# Altium project B100AA Development Kit.PrjPcb (part 2 of 5)

## Sheet Digital Port C State LED Inducator.SchDoc: PORT State LED Inducator
size A3; ApprovedBy: Mehmet Günce Akkoyun; CheckedBy: Mehmet Günce Akkoyun; Author: Mehmet Günce Akkoyun; CompanyName: Ovoo Electronics; DrawnBy: Mehmet Günce Akkoyun; Engineer: Mehmet Günce Akkoyun; Organization: Ovoo Electronics; Address1: Necip Fazýl Mah. Ortaýrmak Sok.; Address2: Birgül Apt. No: 19/6; Address3: Meram / Konya; Address4: Turkiye; DocumentNumber: AA001; Revision: B100AA Dev Kit
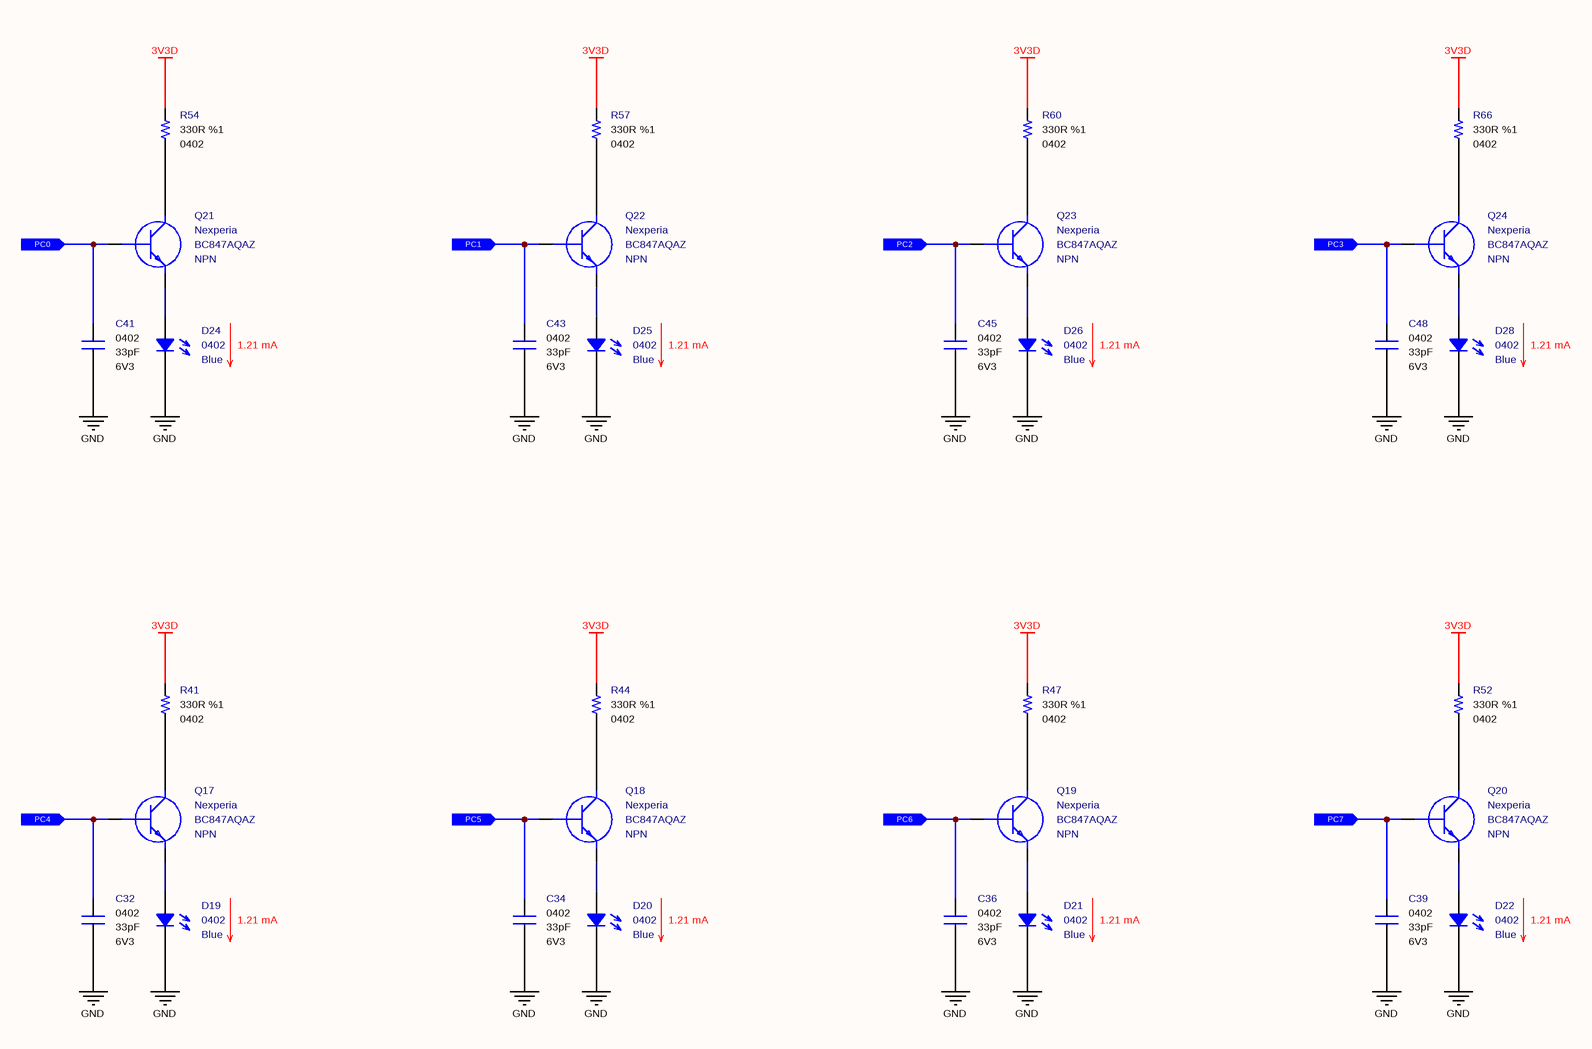
[diagram p8: Digital Port C State LED Inducator.SchDoc]

### Parts
C32  value 33pF  Case: 0402  Voltage: 6V3  [CAPACITOR_0402]  (hidden comment: Multilayer Ceramic Capacitor)
C34  value 33pF  Case: 0402  Voltage: 6V3  [CAPACITOR_0402]  (hidden comment: Multilayer Ceramic Capacitor)
C36  value 33pF  Case: 0402  Voltage: 6V3  [CAPACITOR_0402]  (hidden comment: Multilayer Ceramic Capacitor)
C39  value 33pF  Case: 0402  Voltage: 6V3  [CAPACITOR_0402]  (hidden comment: Multilayer Ceramic Capacitor)
C41  value 33pF  Case: 0402  Voltage: 6V3  [CAPACITOR_0402]  (hidden comment: Multilayer Ceramic Capacitor)
C43  value 33pF  Case: 0402  Voltage: 6V3  [CAPACITOR_0402]  (hidden comment: Multilayer Ceramic Capacitor)
C45  value 33pF  Case: 0402  Voltage: 6V3  [CAPACITOR_0402]  (hidden comment: Multilayer Ceramic Capacitor)
C48  value 33pF  Case: 0402  Voltage: 6V3  [CAPACITOR_0402]  (hidden comment: Multilayer Ceramic Capacitor)
D19  Case: 0402  Color: Blue  [LED_0402]  (hidden comment: SMD LED (Blue))
D20  Case: 0402  Color: Blue  [LED_0402]  (hidden comment: SMD LED (Blue))
D21  Case: 0402  Color: Blue  [LED_0402]  (hidden comment: SMD LED (Blue))
D22  Case: 0402  Color: Blue  [LED_0402]  (hidden comment: SMD LED (Blue))
D24  Case: 0402  Color: Blue  [LED_0402]  (hidden comment: SMD LED (Blue))
D25  Case: 0402  Color: Blue  [LED_0402]  (hidden comment: SMD LED (Blue))
D26  Case: 0402  Color: Blue  [LED_0402]  (hidden comment: SMD LED (Blue))
D28  Case: 0402  Color: Blue  [LED_0402]  (hidden comment: SMD LED (Blue))
Q17  Manufacturer_Name: Nexperia  Manufacturer_Part_Number: BC847AQAZ  Polarity: NPN  [SOT1215]  (hidden comment: Bipolar NPN Transistors)
Q18  Manufacturer_Name: Nexperia  Manufacturer_Part_Number: BC847AQAZ  Polarity: NPN  [SOT1215]  (hidden comment: Bipolar NPN Transistors)
Q19  Manufacturer_Name: Nexperia  Manufacturer_Part_Number: BC847AQAZ  Polarity: NPN  [SOT1215]  (hidden comment: Bipolar NPN Transistors)
Q20  Manufacturer_Name: Nexperia  Manufacturer_Part_Number: BC847AQAZ  Polarity: NPN  [SOT1215]  (hidden comment: Bipolar NPN Transistors)
Q21  Manufacturer_Name: Nexperia  Manufacturer_Part_Number: BC847AQAZ  Polarity: NPN  [SOT1215]  (hidden comment: Bipolar NPN Transistors)
Q22  Manufacturer_Name: Nexperia  Manufacturer_Part_Number: BC847AQAZ  Polarity: NPN  [SOT1215]  (hidden comment: Bipolar NPN Transistors)
Q23  Manufacturer_Name: Nexperia  Manufacturer_Part_Number: BC847AQAZ  Polarity: NPN  [SOT1215]  (hidden comment: Bipolar NPN Transistors)
Q24  Manufacturer_Name: Nexperia  Manufacturer_Part_Number: BC847AQAZ  Polarity: NPN  [SOT1215]  (hidden comment: Bipolar NPN Transistors)
R41  value 330R  Tolerance: %1  Case: 0402  [RESISTOR_0402]  (hidden comment: Thick Film Resistor)
R44  value 330R  Tolerance: %1  Case: 0402  [RESISTOR_0402]  (hidden comment: Thick Film Resistor)
R47  value 330R  Tolerance: %1  Case: 0402  [RESISTOR_0402]  (hidden comment: Thick Film Resistor)
R52  value 330R  Tolerance: %1  Case: 0402  [RESISTOR_0402]  (hidden comment: Thick Film Resistor)
R54  value 330R  Tolerance: %1  Case: 0402  [RESISTOR_0402]  (hidden comment: Thick Film Resistor)
R57  value 330R  Tolerance: %1  Case: 0402  [RESISTOR_0402]  (hidden comment: Thick Film Resistor)
R60  value 330R  Tolerance: %1  Case: 0402  [RESISTOR_0402]  (hidden comment: Thick Film Resistor)
R66  value 330R  Tolerance: %1  Case: 0402  [RESISTOR_0402]  (hidden comment: Thick Film Resistor)

### Ports
PC0 (in), PC1 (in), PC2 (in), PC3 (in), PC4 (in), PC5 (in), PC6 (in), PC7 (in)

### Nets
3V3D: R41.2 R44.2 R47.2 R52.2 R54.2 R57.2 R60.2 R66.2
GND: C32.2 C34.2 C36.2 C39.2 C41.2 C43.2 C45.2 C48.2 D19.1 D20.1 D21.1 D22.1 D24.1 D25.1 D26.1 D28.1
PC0: C41.1 Q21.1(B) ; port PC0
PC1: C43.1 Q22.1(B) ; port PC1
PC2: C45.1 Q23.1(B) ; port PC2
PC3: C48.1 Q24.1(B) ; port PC3
PC4: C32.1 Q17.1(B) ; port PC4
PC5: C34.1 Q18.1(B) ; port PC5
PC6: C36.1 Q19.1(B) ; port PC6
PC7: C39.1 Q20.1(B) ; port PC7
NetD19_2: D19.2 Q17.2(E)
NetD20_2: D20.2 Q18.2(E)
NetD21_2: D21.2 Q19.2(E)
NetD22_2: D22.2 Q20.2(E)
NetD24_2: D24.2 Q21.2(E)
NetD25_2: D25.2 Q22.2(E)
NetD26_2: D26.2 Q23.2(E)
NetD28_2: D28.2 Q24.2(E)
NetQ17_3: Q17.3(C) R41.1
NetQ18_3: Q18.3(C) R44.1
NetQ19_3: Q19.3(C) R47.1
NetQ20_3: Q20.3(C) R52.1
NetQ21_3: Q21.3(C) R54.1
NetQ22_3: Q22.3(C) R57.1
NetQ23_3: Q23.3(C) R60.1
NetQ24_3: Q24.3(C) R66.1

### Notes on the sheet
- 1.21 mA
- Title
- Size:
- Date:
- A3
- Number:
- Time:
- Revision:
- Sheet
- of
- File:

### Library data of the parts
C32 C34 C36 C39 C41 C43 C45 C48 = Capacitor - 33pF [0402-6V3]: as C2 on sheet Digital Port A State LED Inducator; Height: 0.5mm; Maximum Operating Temperature: +125; Minimum Operating Temperature: -55; ROHS: Yes; ComponentLink1Description: DataSheet; ComponentLink1URL: https://api.kemet.com/component-edge/download/datasheet/C0402C330J9RACAUTO.pdf; ComponentLink2Description: Mouser; ComponentLink2URL: https://www.mouser.com/Search/Refine.aspx?Keyword=80-C0402C330J9RAUTO; Supplier 1: Mouser; Supplier Part Number 1: 80-C0402C330J9RAUTO; Mouser Part Number: 80-C0402C330J9RAUTO
D19-D22 D24-D26 D28 = Diode - LED (0402-Blue): as D1 on sheet Digital Port A State LED Inducator; Mouser_Part_Number: 755-SMLP13BC8TT86; ROHS: Yes; ComponentLink1Description: DataSheet; ComponentLink1URL: https://d1d2qsbl8m0m72.cloudfront.net/en/products/databook/datasheet/opto/led/chip_mono/sml-p1-e.pdf; ComponentLink2Description: Mouser; ComponentLink2URL: https://www.mouser.com.tr/ProductDetail/ROHM-Semiconductor/SMLP13BC8TT86?qs=%2Fha2pyFaduidYDgXFKL%252BNZwCVZNUI4FlyPWWbVDx1b6ABmzS%252BS2f0w%3D%3D; Supplier 1: Mouser; Supplier 2: Digi-Key; Supplier Part Number 1: 755-SMLP13BC8TT86; Supplier Part Number 2: 846-1112-1-ND
Q17-Q24 = Transistor - BC847: as Q1 on sheet Digital Port A State LED Inducator; Mouser_Part_Number: 771-BC847AQAZ; ComponentLink1Description: DataSheet; ComponentLink1URL: https://www.mouser.com.tr/datasheet/2/916/BC847XQA_SER-1598405.pdf; ComponentLink2Description: Mouser; ComponentLink2URL: https://www.mouser.com.tr/ProductDetail/Nexperia/BC847AQAZ?qs=%2Fha2pyFaduhKMCPKNtQimeJpXTw9z4AqURd2YARs8DVICZNv3AT9Dw%3D%3D; Case: DFN-1010D-3; Supplier 1: Mouser; Supplier 2: Digi-Key; Supplier Part Number 1: 771-BC847AQAZ; Supplier Part Number 2: 1727-2545-1-ND
R41 R44 R47 R52 R54 R57 R60 R66 = Resistor - 330R: as R2 on sheet Digital Port A State LED Inducator; Height: 0.4mm; ComponentLink1Description: DataSheet; ComponentLink1URL: https://www.mouser.com.tr/datasheet/2/427/dcrcwe3-1762152.pdf; ComponentLink2Description: Mouser; ComponentLink2URL: https://www.mouser.com.tr/ProductDetail/Vishay-Dale/CRCW0402330RFKED?qs=sGAEpiMZZMu61qfTUdNhG2DpbjADlD3GGS6SwBlLi5Q%3D; Supplier 1: Mouser; Supplier 2: Digi-Key; Supplier Part Number 2: 541-330LCT-ND; Supplier Part Number 1: 71-CRCW0402-330-E3; Mouser Part Number: 71-CRCW0402-330-E3

## Sheet Digital Port C Button.SchDoc: PORT State Change Buttons
size A4; ApprovedBy: Mehmet Günce Akkoyun; CheckedBy: Mehmet Günce Akkoyun; Author: Mehmet Günce Akkoyun; CompanyName: Ovoo Electronics; DrawnBy: Mehmet Günce Akkoyun; Engineer: Mehmet Günce Akkoyun; Organization: Ovoo Electronics; Address1: Necip Fazýl Mah. Ortaýrmak Sok.; Address2: Birgül Apt. No: 19/6; Address3: Meram / Konya; Address4: Turkiye; DocumentNumber: AA001; Revision: B100AA Dev Kit
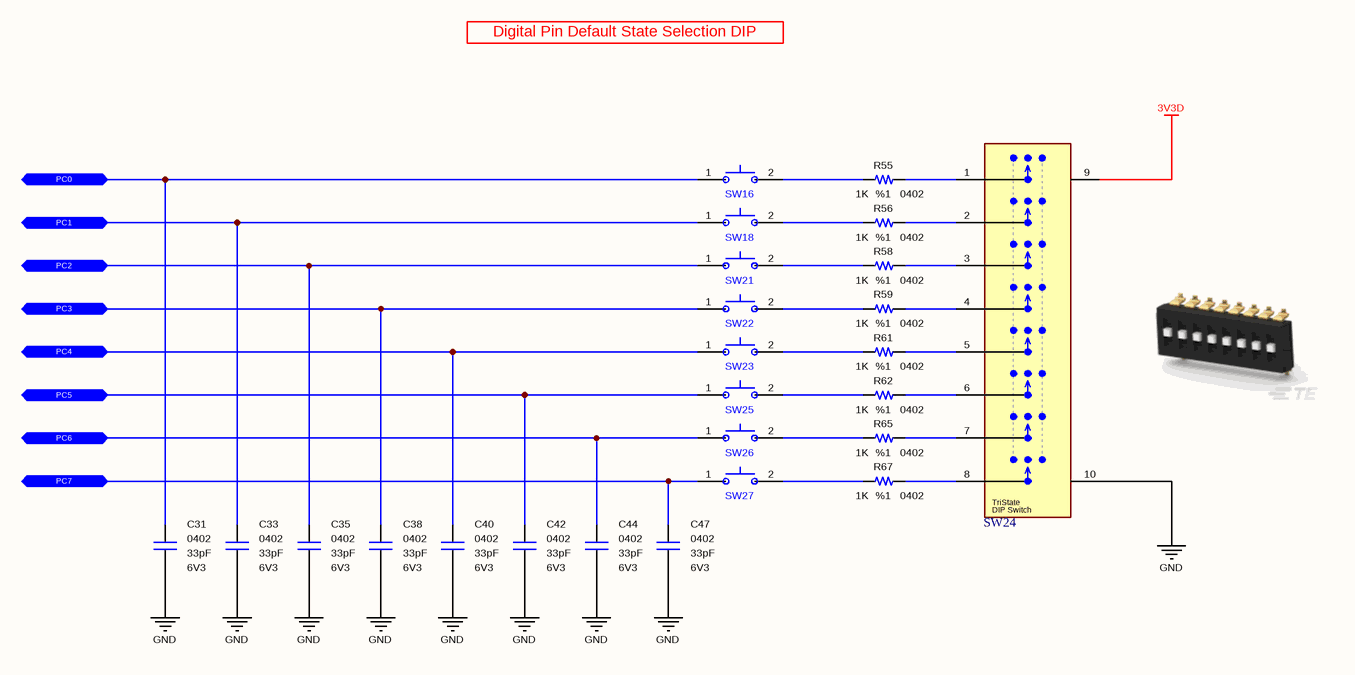
[diagram p9: Digital Port C Button.SchDoc]

### Parts
C31  value 33pF  Case: 0402  Voltage: 6V3  [CAPACITOR_0402]  (hidden comment: Multilayer Ceramic Capacitor)
C33  value 33pF  Case: 0402  Voltage: 6V3  [CAPACITOR_0402]  (hidden comment: Multilayer Ceramic Capacitor)
C35  value 33pF  Case: 0402  Voltage: 6V3  [CAPACITOR_0402]  (hidden comment: Multilayer Ceramic Capacitor)
C38  value 33pF  Case: 0402  Voltage: 6V3  [CAPACITOR_0402]  (hidden comment: Multilayer Ceramic Capacitor)
C40  value 33pF  Case: 0402  Voltage: 6V3  [CAPACITOR_0402]  (hidden comment: Multilayer Ceramic Capacitor)
C42  value 33pF  Case: 0402  Voltage: 6V3  [CAPACITOR_0402]  (hidden comment: Multilayer Ceramic Capacitor)
C44  value 33pF  Case: 0402  Voltage: 6V3  [CAPACITOR_0402]  (hidden comment: Multilayer Ceramic Capacitor)
C47  value 33pF  Case: 0402  Voltage: 6V3  [CAPACITOR_0402]  (hidden comment: Multilayer Ceramic Capacitor)
R55  value 1K  Tolerance: %1  Case: 0402  [RESISTOR_0402]  (hidden comment: Thick Film Resistor)
R56  value 1K  Tolerance: %1  Case: 0402  [RESISTOR_0402]  (hidden comment: Thick Film Resistor)
R58  value 1K  Tolerance: %1  Case: 0402  [RESISTOR_0402]  (hidden comment: Thick Film Resistor)
R59  value 1K  Tolerance: %1  Case: 0402  [RESISTOR_0402]  (hidden comment: Thick Film Resistor)
R61  value 1K  Tolerance: %1  Case: 0402  [RESISTOR_0402]  (hidden comment: Thick Film Resistor)
R62  value 1K  Tolerance: %1  Case: 0402  [RESISTOR_0402]  (hidden comment: Thick Film Resistor)
R65  value 1K  Tolerance: %1  Case: 0402  [RESISTOR_0402]  (hidden comment: Thick Film Resistor)
R67  value 1K  Tolerance: %1  Case: 0402  [RESISTOR_0402]  (hidden comment: Thick Film Resistor)
SW16  Tactile Switches  [PTS526_Switch]  (value not drawn)
SW18  Tactile Switches  [PTS526_Switch]  (value not drawn)
SW21  Tactile Switches  [PTS526_Switch]  (value not drawn)
SW22  Tactile Switches  [PTS526_Switch]  (value not drawn)
SW23  Tactile Switches  [PTS526_Switch]  (value not drawn)
SW24  DIP Switches/SIP Switches  [TDS08SGNNTR04]  (value not drawn)
SW25  Tactile Switches  [PTS526_Switch]  (value not drawn)
SW26  Tactile Switches  [PTS526_Switch]  (value not drawn)
SW27  Tactile Switches  [PTS526_Switch]  (value not drawn)

### Ports
PC0 (bidir), PC1 (bidir), PC2 (bidir), PC3 (bidir), PC4 (bidir), PC5 (bidir), PC6 (bidir), PC7 (bidir)

### Nets
3V3D: SW24.9(VCC)
GND: C31.1 C33.1 C35.1 C38.1 C40.1 C42.1 C44.1 C47.1 SW24.10(GND)
PC0: C31.2 SW16.1(NC) ; port PC0
PC1: C33.2 SW18.1(NC) ; port PC1
PC2: C35.2 SW21.1(NC) ; port PC2
PC3: C38.2 SW22.1(NC) ; port PC3
PC4: C40.2 SW23.1(NC) ; port PC4
PC5: C42.2 SW25.1(NC) ; port PC5
PC6: C44.2 SW26.1(NC) ; port PC6
PC7: C47.2 SW27.1(NC) ; port PC7
NetR55_1: R55.1 SW24.1
NetR55_2: R55.2 SW16.2(COM)
NetR56_1: R56.1 SW24.2
NetR56_2: R56.2 SW18.2(COM)
NetR58_1: R58.1 SW24.3
NetR58_2: R58.2 SW21.2(COM)
NetR59_1: R59.1 SW24.4
NetR59_2: R59.2 SW22.2(COM)
NetR61_1: R61.1 SW24.5
NetR61_2: R61.2 SW23.2(COM)
NetR62_1: R62.1 SW24.6
NetR62_2: R62.2 SW25.2(COM)
NetR65_1: R65.1 SW24.7
NetR65_2: R65.2 SW26.2(COM)
NetR67_1: R67.1 SW24.8
NetR67_2: R67.2 SW27.2(COM)

### Notes on the sheet
- Digital Pin Default State Selection DIP
- Title
- Size:
- Date:
- A4
- Number:
- Time:
- Revision:
- Sheet
- of
- File:
- (in symbol Switch - DIP Switch (8 Pole TriState)) TriState; DIP Switch

### Library data of the parts
C31 C33 C35 C38 C40 C42 C44 C47 = Capacitor - 33pF [0402-6V3]: as C2 on sheet Digital Port A State LED Inducator; Height: 0.5mm; Mouser Part Number: 80-C0402C330J9RAUTO; Maximum Operating Temperature: +125; Minimum Operating Temperature: -55; ROHS: Yes; ComponentLink1Description: DataSheet; ComponentLink1URL: https://api.kemet.com/component-edge/download/datasheet/C0402C330J9RACAUTO.pdf; ComponentLink2Description: Mouser; ComponentLink2URL: https://www.mouser.com/Search/Refine.aspx?Keyword=80-C0402C330J9RAUTO; Supplier 1: Mouser; Supplier Part Number 1: 80-C0402C330J9RAUTO
R55 R56 R58 R59 R61 R62 R65 R67 = Resistor - 1K: as R18 on sheet Digital Port A Button; Height: 0.35mm; Mouser Part Number: 71-CRCW0402-1.0K-E3; ComponentLink1Description: DataSheet; ComponentLink1URL: https://www.mouser.com.tr/datasheet/2/427/dcrcwe3-1762152.pdf; ComponentLink2Description: Mouser; ComponentLink2URL: https://www.mouser.com.tr/ProductDetail/Vishay-Dale/CRCW04021K00FKED?qs=sGAEpiMZZMu61qfTUdNhG2DpbjADlD3GFJ4zSbeLqG8%3D; Supplier 1: Mouser; Supplier 2: Digi-Key; Supplier Part Number 1: 71-CRCW0402-1.0K-E3; Supplier Part Number 2: 541-1.00KLCT-ND
SW16 SW18 SW21-SW23 SW25-SW27 = Switch - Tactile: as SW1 on sheet Digital Port A Button; Height: 0.8mm; Mouser Part Number: 611-PTS526SK08SMTR2L; ComponentLink1Description: DataSheet; ComponentLink1URL: https://eu.mouser.com/datasheet/2/60/pts526-1651200.pdf; ComponentLink2Description: Mouser; ComponentLink2URL: https://eu.mouser.com/ProductDetail/CK/PTS526-SK08-SMTR2-LFS?qs=sGAEpiMZZMsgGjVA3toVBL%2FRce%252ByN3s1hQPqiLlQ%252BeM%3D; Supplier 1: Future Electronics; Supplier 2: Mouser; Supplier 3: Arrow; Supplier 4: Digi-Key; Supplier Part Number 1: PTS526SK08SMTR2LFS-REEL; Supplier Part Number 2: 611-PTS526SK08SMTR2L; Supplier Part Number 3: PTS526 SK08 SMTR2 LFS; Supplier Part Number 4: CKN12219-1-ND
SW24 = Switch - DIP Switch (8 Pole TriState): as SW2 on sheet Digital Port A Default State DIP; Manufacturer Part Number: TDS08SGNNTR04; Mouser Part Number: 506-TDS08SGNNTR04; ComponentLink1Description: DataSheet; ComponentLink1URL: https://www.mouser.com.tr/datasheet/2/418/4/NG_DS_1-1773931-8_ALCOSWITCH_DIP_TDS_0917-1221113.pdf; ComponentLink2Description: Mouser; ComponentLink2URL: https://www.mouser.com.tr/ProductDetail/TE-Connectivity-Alcoswitch/TDS08SGNNTR04/?qs=wd5RIQLrsJiLOOX2pWoyQw==

## Sheet Digital Port F.SchDoc: Port F Digital Control
size A4; ApprovedBy: Mehmet Günce Akkoyun; CheckedBy: Mehmet Günce Akkoyun; Author: Mehmet Günce Akkoyun; CompanyName: Ovoo Electronics; DrawnBy: Mehmet Günce Akkoyun; Engineer: Mehmet Günce Akkoyun; Organization: Ovoo Electronics; Address1: Necip Fazýl Mah. Ortaýrmak Sok.; Address2: Birgül Apt. No: 19/6; Address3: Meram / Konya; Address4: Turkiye; DocumentNumber: AA001; Revision: B100AA Dev Kit
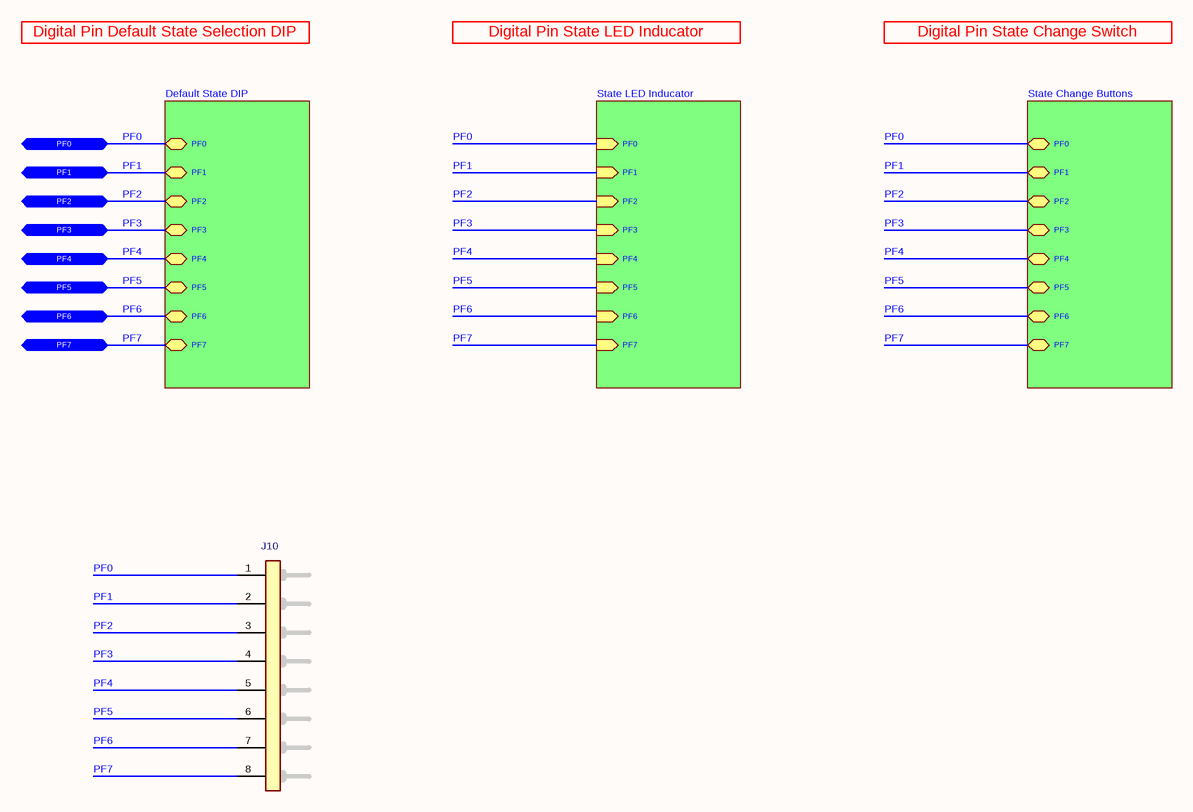
[diagram p10: Digital Port F.SchDoc]

### Parts
J10  2.54 mm Pitch 8P Male Connector  [8P Header]  (value not drawn)

### Sub-sheets
Default State DIP = Digital Port F Default State DIP.SchDoc: PF1 (bidir), PF0 (bidir), PF7 (bidir), PF4 (bidir), PF6 (bidir), PF3 (bidir), PF5 (bidir), PF2 (bidir)
State Change Buttons = Digital Port F Button.SchDoc: PF1 (bidir), PF0 (bidir), PF7 (bidir), PF4 (bidir), PF6 (bidir), PF3 (bidir), PF5 (bidir), PF2 (bidir)
State LED Inducator = Digital Port F State LED Inducator.SchDoc: PF1 (in), PF0 (in), PF7 (in), PF4 (in), PF6 (in), PF3 (in), PF5 (in), PF2 (in)

### Ports
PF0 (bidir), PF1 (bidir), PF2 (bidir), PF3 (bidir), PF4 (bidir), PF5 (bidir), PF6 (bidir), PF7 (bidir)

### Nets
PF0: J10.1(Pin-1) ; port PF0, sheet Default State DIP/PF0, sheet State LED Inducator/PF0, sheet State Change Buttons/PF0
PF1: J10.2(Pin-2) ; port PF1, sheet Default State DIP/PF1, sheet State LED Inducator/PF1, sheet State Change Buttons/PF1
PF2: J10.3(Pin-3) ; port PF2, sheet Default State DIP/PF2, sheet State LED Inducator/PF2, sheet State Change Buttons/PF2
PF3: J10.4(Pin-4) ; port PF3, sheet Default State DIP/PF3, sheet State LED Inducator/PF3, sheet State Change Buttons/PF3
PF4: J10.5(Pin-5) ; port PF4, sheet Default State DIP/PF4, sheet State LED Inducator/PF4, sheet State Change Buttons/PF4
PF5: J10.6(Pin-6) ; port PF5, sheet Default State DIP/PF5, sheet State LED Inducator/PF5, sheet State Change Buttons/PF5
PF6: J10.7(Pin-7) ; port PF6, sheet Default State DIP/PF6, sheet State LED Inducator/PF6, sheet State Change Buttons/PF6
PF7: J10.8(Pin-8) ; port PF7, sheet Default State DIP/PF7, sheet State LED Inducator/PF7, sheet State Change Buttons/PF7

### Notes on the sheet
- Digital Pin Default State Selection DIP
- Digital Pin State LED Inducator
- Digital Pin State Change Switch
- Title
- Size:
- Date:
- A4
- Number:
- Time:
- Revision:
- Sheet
- of
- File:

### Library data of the parts
J10 = Connector - Male Header 8P (2.54): Headers & Wire Housings BREAKAWAY HDR VERT 8; Manufacturer Name: Molex; Position: 8; Row: 1; Pitch: 2.54 mm; Manufacturer Part Number: 22-28-4083; Mouser Part Number: 538-22-28-4083; ROHS: Yes; ComponentLink1Description: DataSheet; ComponentLink1URL: https://www.mouser.com.tr/datasheet/2/276/0022284063_PCB_HEADERS-228265.pdf; ComponentLink2Description: Mouser; ComponentLink2URL: https://www.mouser.com.tr/ProductDetail/Molex/22-28-4083/?qs=%2Fha2pyFaduguMWEp6M%252Bj0x6fHxUvnRGD%252BIxBoa6MO5w%3D

## Sheet Digital Port F Default State DIP.SchDoc: PORT F Default State Selection Switch
size A4; ApprovedBy: Mehmet Günce Akkoyun; CheckedBy: Mehmet Günce Akkoyun; Author: Mehmet Günce Akkoyun; CompanyName: Ovoo Electronics; DrawnBy: Mehmet Günce Akkoyun; Engineer: Mehmet Günce Akkoyun; Organization: Ovoo Electronics; Address1: Necip Fazýl Mah. Ortaýrmak Sok.; Address2: Birgül Apt. No: 19/6; Address3: Meram / Konya; Address4: Turkiye; DocumentNumber: AA001; Revision: B100AA Dev Kit
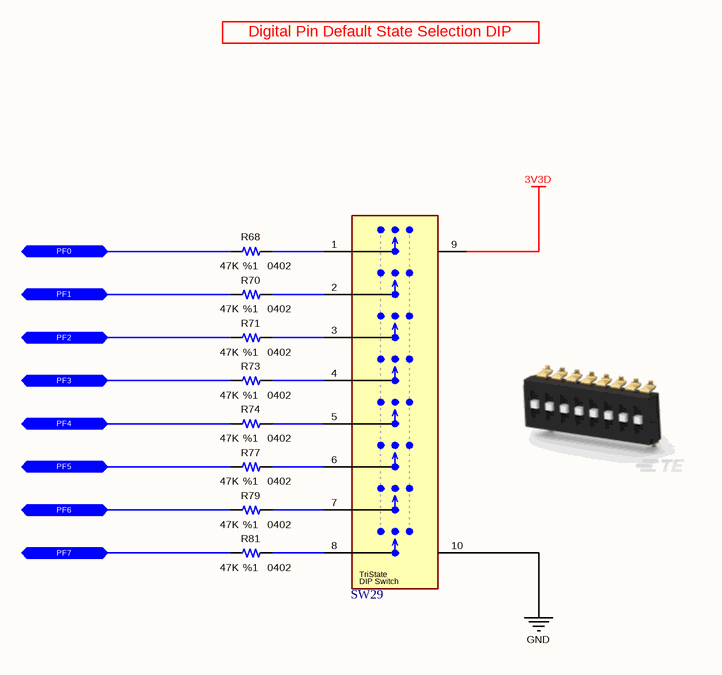
[diagram p11: Digital Port F Default State DIP.SchDoc]

### Parts
R68  value 47K  Tolerance: %1  Case: 0402  [RESISTOR_0402]  (hidden comment: Thick Film Resistor)
R70  value 47K  Tolerance: %1  Case: 0402  [RESISTOR_0402]  (hidden comment: Thick Film Resistor)
R71  value 47K  Tolerance: %1  Case: 0402  [RESISTOR_0402]  (hidden comment: Thick Film Resistor)
R73  value 47K  Tolerance: %1  Case: 0402  [RESISTOR_0402]  (hidden comment: Thick Film Resistor)
R74  value 47K  Tolerance: %1  Case: 0402  [RESISTOR_0402]  (hidden comment: Thick Film Resistor)
R77  value 47K  Tolerance: %1  Case: 0402  [RESISTOR_0402]  (hidden comment: Thick Film Resistor)
R79  value 47K  Tolerance: %1  Case: 0402  [RESISTOR_0402]  (hidden comment: Thick Film Resistor)
R81  value 47K  Tolerance: %1  Case: 0402  [RESISTOR_0402]  (hidden comment: Thick Film Resistor)
SW29  DIP Switches/SIP Switches  [TDS08SGNNTR04]  (value not drawn)

### Ports
PF0 (bidir), PF1 (bidir), PF2 (bidir), PF3 (bidir), PF4 (bidir), PF5 (bidir), PF6 (bidir), PF7 (bidir)

### Nets
3V3D: SW29.9(VCC)
GND: SW29.10(GND)
PF0: R68.2 ; port PF0
PF1: R70.2 ; port PF1
PF2: R71.2 ; port PF2
PF3: R73.2 ; port PF3
PF4: R74.2 ; port PF4
PF5: R77.2 ; port PF5
PF6: R79.2 ; port PF6
PF7: R81.2 ; port PF7
NetR68_1: R68.1 SW29.1
NetR70_1: R70.1 SW29.2
NetR71_1: R71.1 SW29.3
NetR73_1: R73.1 SW29.4
NetR74_1: R74.1 SW29.5
NetR77_1: R77.1 SW29.6
NetR79_1: R79.1 SW29.7
NetR81_1: R81.1 SW29.8

### Notes on the sheet
- Digital Pin Default State Selection DIP
- Title
- Size:
- Date:
- A4
- Number:
- Time:
- Revision:
- Sheet
- of
- File:
- (in symbol Switch - DIP Switch (8 Pole TriState)) TriState; DIP Switch

### Library data of the parts
R68 R70 R71 R73 R74 R77 R79 R81 = Resistor - 47K: Thick Film Resistors - SMD 1/16 W 47 Kohms 1%; Manufacturer Name: Vishay; Manufacturer Part Number: CRCW040247K0FKED; Height: 0.4mm; Mouser Part Number: 71-CRCW0402-47K-E3; ComponentLink1Description: DataSheet; ComponentLink1URL: https://www.mouser.com.tr/datasheet/2/427/dcrcwe3-1762152.pdf; ComponentLink2Description: Mouser; ComponentLink2URL: https://www.mouser.com.tr/ProductDetail/Vishay-Dale/CRCW040247K0FKED?qs=sGAEpiMZZMu61qfTUdNhG2DpbjADlD3GL%252B3h1elTxqU%3D; Supplier 1: Mouser; Supplier 2: Digi-Key; Supplier Part Number 1: 71-CRCW040247K0FKEDH; Supplier Part Number 2: 541-47.0KYCT-ND
SW29 = Switch - DIP Switch (8 Pole TriState): DIP Switches/SIP Switches TRI-STATE DIP 8P G RAISED T&R; Manufacturer Name: TE Connectivity; Manufacturer Part Number: TDS08SGNNTR04; Mouser Part Number: 506-TDS08SGNNTR04; ComponentLink1Description: DataSheet; ComponentLink1URL: https://www.mouser.com.tr/datasheet/2/418/4/NG_DS_1-1773931-8_ALCOSWITCH_DIP_TDS_0917-1221113.pdf; ComponentLink2Description: Mouser; ComponentLink2URL: https://www.mouser.com.tr/ProductDetail/TE-Connectivity-Alcoswitch/TDS08SGNNTR04/?qs=wd5RIQLrsJiLOOX2pWoyQw==

## Sheet Digital Port F State LED Inducator.SchDoc: PORT State LED Inducator
size A3; ApprovedBy: Mehmet Günce Akkoyun; CheckedBy: Mehmet Günce Akkoyun; Author: Mehmet Günce Akkoyun; CompanyName: Ovoo Electronics; DrawnBy: Mehmet Günce Akkoyun; Engineer: Mehmet Günce Akkoyun; Organization: Ovoo Electronics; Address1: Necip Fazýl Mah. Ortaýrmak Sok.; Address2: Birgül Apt. No: 19/6; Address3: Meram / Konya; Address4: Turkiye; DocumentNumber: AA001; Revision: B100AA Dev Kit
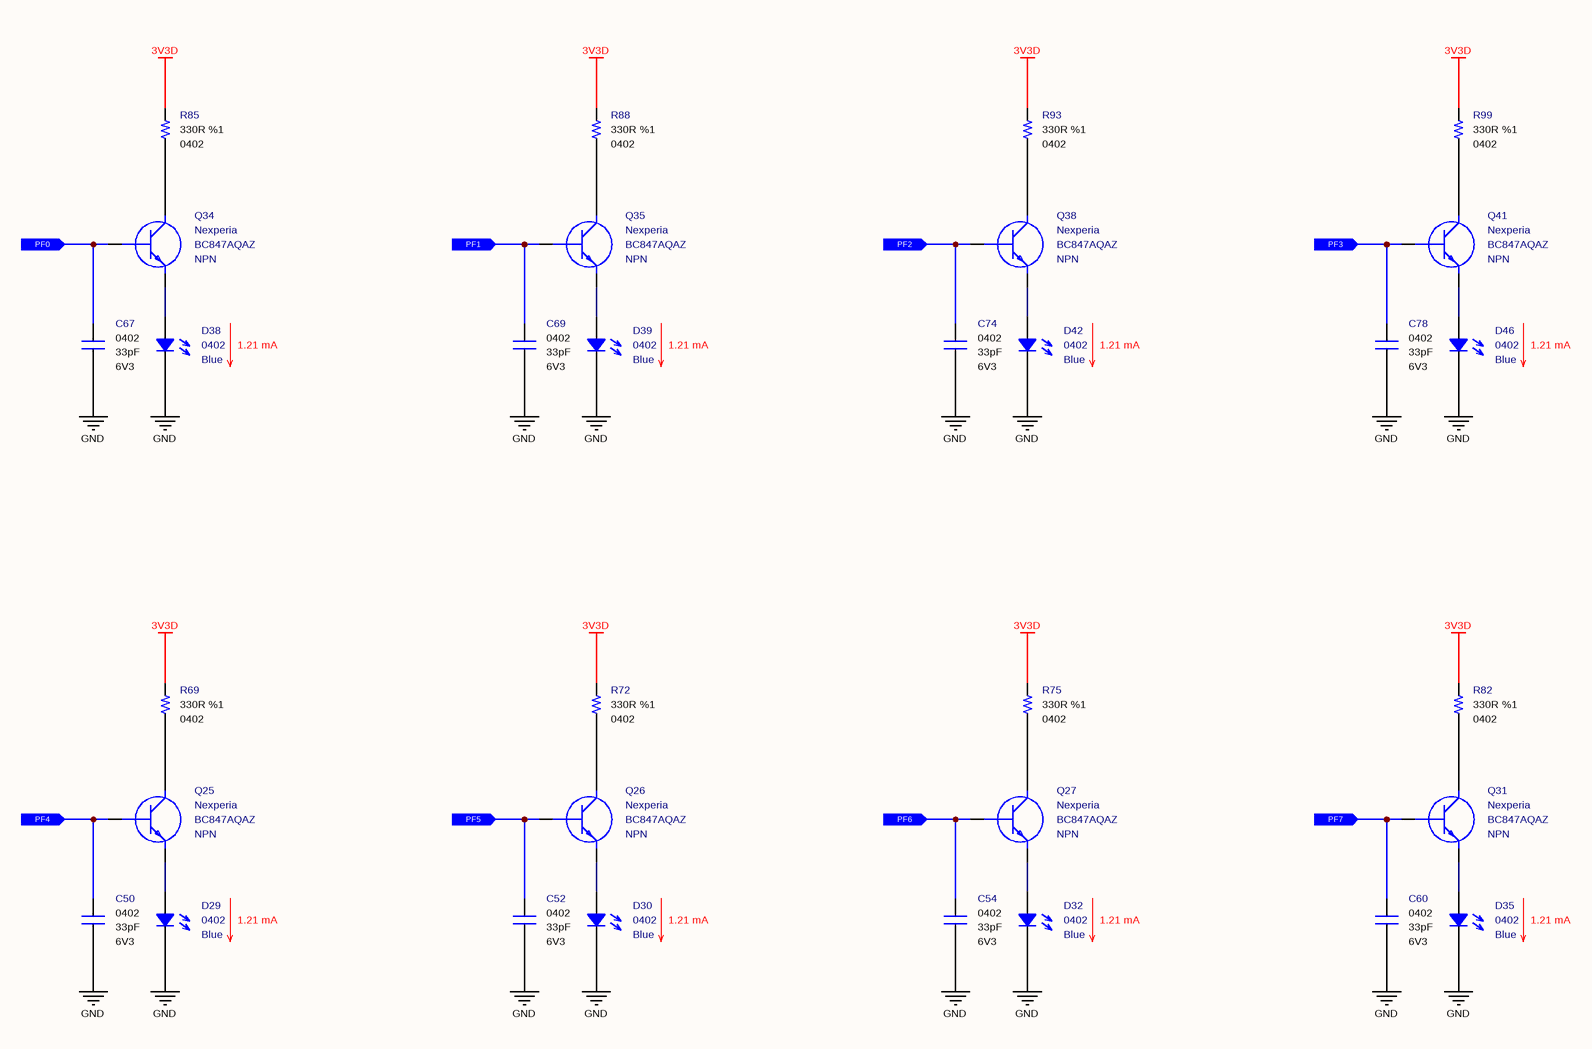
[diagram p12: Digital Port F State LED Inducator.SchDoc]

### Parts
C50  value 33pF  Case: 0402  Voltage: 6V3  [CAPACITOR_0402]  (hidden comment: Multilayer Ceramic Capacitor)
C52  value 33pF  Case: 0402  Voltage: 6V3  [CAPACITOR_0402]  (hidden comment: Multilayer Ceramic Capacitor)
C54  value 33pF  Case: 0402  Voltage: 6V3  [CAPACITOR_0402]  (hidden comment: Multilayer Ceramic Capacitor)
C60  value 33pF  Case: 0402  Voltage: 6V3  [CAPACITOR_0402]  (hidden comment: Multilayer Ceramic Capacitor)
C67  value 33pF  Case: 0402  Voltage: 6V3  [CAPACITOR_0402]  (hidden comment: Multilayer Ceramic Capacitor)
C69  value 33pF  Case: 0402  Voltage: 6V3  [CAPACITOR_0402]  (hidden comment: Multilayer Ceramic Capacitor)
C74  value 33pF  Case: 0402  Voltage: 6V3  [CAPACITOR_0402]  (hidden comment: Multilayer Ceramic Capacitor)
C78  value 33pF  Case: 0402  Voltage: 6V3  [CAPACITOR_0402]  (hidden comment: Multilayer Ceramic Capacitor)
D29  Case: 0402  Color: Blue  [LED_0402]  (hidden comment: SMD LED (Blue))
D30  Case: 0402  Color: Blue  [LED_0402]  (hidden comment: SMD LED (Blue))
D32  Case: 0402  Color: Blue  [LED_0402]  (hidden comment: SMD LED (Blue))
D35  Case: 0402  Color: Blue  [LED_0402]  (hidden comment: SMD LED (Blue))
D38  Case: 0402  Color: Blue  [LED_0402]  (hidden comment: SMD LED (Blue))
D39  Case: 0402  Color: Blue  [LED_0402]  (hidden comment: SMD LED (Blue))
D42  Case: 0402  Color: Blue  [LED_0402]  (hidden comment: SMD LED (Blue))
D46  Case: 0402  Color: Blue  [LED_0402]  (hidden comment: SMD LED (Blue))
Q25  Manufacturer_Name: Nexperia  Manufacturer_Part_Number: BC847AQAZ  Polarity: NPN  [SOT1215]  (hidden comment: Bipolar NPN Transistors)
Q26  Manufacturer_Name: Nexperia  Manufacturer_Part_Number: BC847AQAZ  Polarity: NPN  [SOT1215]  (hidden comment: Bipolar NPN Transistors)
Q27  Manufacturer_Name: Nexperia  Manufacturer_Part_Number: BC847AQAZ  Polarity: NPN  [SOT1215]  (hidden comment: Bipolar NPN Transistors)
Q31  Manufacturer_Name: Nexperia  Manufacturer_Part_Number: BC847AQAZ  Polarity: NPN  [SOT1215]  (hidden comment: Bipolar NPN Transistors)
Q34  Manufacturer_Name: Nexperia  Manufacturer_Part_Number: BC847AQAZ  Polarity: NPN  [SOT1215]  (hidden comment: Bipolar NPN Transistors)
Q35  Manufacturer_Name: Nexperia  Manufacturer_Part_Number: BC847AQAZ  Polarity: NPN  [SOT1215]  (hidden comment: Bipolar NPN Transistors)
Q38  Manufacturer_Name: Nexperia  Manufacturer_Part_Number: BC847AQAZ  Polarity: NPN  [SOT1215]  (hidden comment: Bipolar NPN Transistors)
Q41  Manufacturer_Name: Nexperia  Manufacturer_Part_Number: BC847AQAZ  Polarity: NPN  [SOT1215]  (hidden comment: Bipolar NPN Transistors)
R69  value 330R  Tolerance: %1  Case: 0402  [RESISTOR_0402]  (hidden comment: Thick Film Resistor)
R72  value 330R  Tolerance: %1  Case: 0402  [RESISTOR_0402]  (hidden comment: Thick Film Resistor)
R75  value 330R  Tolerance: %1  Case: 0402  [RESISTOR_0402]  (hidden comment: Thick Film Resistor)
R82  value 330R  Tolerance: %1  Case: 0402  [RESISTOR_0402]  (hidden comment: Thick Film Resistor)
R85  value 330R  Tolerance: %1  Case: 0402  [RESISTOR_0402]  (hidden comment: Thick Film Resistor)
R88  value 330R  Tolerance: %1  Case: 0402  [RESISTOR_0402]  (hidden comment: Thick Film Resistor)
R93  value 330R  Tolerance: %1  Case: 0402  [RESISTOR_0402]  (hidden comment: Thick Film Resistor)
R99  value 330R  Tolerance: %1  Case: 0402  [RESISTOR_0402]  (hidden comment: Thick Film Resistor)

### Ports
PF0 (in), PF1 (in), PF2 (in), PF3 (in), PF4 (in), PF5 (in), PF6 (in), PF7 (in)

### Nets
3V3D: R69.2 R72.2 R75.2 R82.2 R85.2 R88.2 R93.2 R99.2
GND: C50.2 C52.2 C54.2 C60.2 C67.2 C69.2 C74.2 C78.2 D29.1 D30.1 D32.1 D35.1 D38.1 D39.1 D42.1 D46.1
PF0: C67.1 Q34.1(B) ; port PF0
PF1: C69.1 Q35.1(B) ; port PF1
PF2: C74.1 Q38.1(B) ; port PF2
PF3: C78.1 Q41.1(B) ; port PF3
PF4: C50.1 Q25.1(B) ; port PF4
PF5: C52.1 Q26.1(B) ; port PF5
PF6: C54.1 Q27.1(B) ; port PF6
PF7: C60.1 Q31.1(B) ; port PF7
NetD29_2: D29.2 Q25.2(E)
NetD30_2: D30.2 Q26.2(E)
NetD32_2: D32.2 Q27.2(E)
NetD35_2: D35.2 Q31.2(E)
NetD38_2: D38.2 Q34.2(E)
NetD39_2: D39.2 Q35.2(E)
NetD42_2: D42.2 Q38.2(E)
NetD46_2: D46.2 Q41.2(E)
NetQ25_3: Q25.3(C) R69.1
NetQ26_3: Q26.3(C) R72.1
NetQ27_3: Q27.3(C) R75.1
NetQ31_3: Q31.3(C) R82.1
NetQ34_3: Q34.3(C) R85.1
NetQ35_3: Q35.3(C) R88.1
NetQ38_3: Q38.3(C) R93.1
NetQ41_3: Q41.3(C) R99.1

### Notes on the sheet
- 1.21 mA
- Title
- Size:
- Date:
- A3
- Number:
- Time:
- Revision:
- Sheet
- of
- File:

### Library data of the parts
C50 C52 C54 C60 C67 C69 C74 C78 = Capacitor - 33pF [0402-6V3]: Capacitor - 33pF [0402] (Ceramic); Manufacturer Name: Kemet; Manufacturer Part Number: C0402C330J9RACAUTO; Dielectric: X7R; Tolerance: 10%; Height: 0.5mm; Maximum Operating Temperature: +125; Minimum Operating Temperature: -55; ROHS: Yes; ComponentLink1Description: DataSheet; ComponentLink1URL: https://api.kemet.com/component-edge/download/datasheet/C0402C330J9RACAUTO.pdf; ComponentLink2Description: Mouser; ComponentLink2URL: https://www.mouser.com/Search/Refine.aspx?Keyword=80-C0402C330J9RAUTO; Supplier 1: Mouser; Supplier Part Number 1: 80-C0402C330J9RAUTO; Mouser Part Number: 80-C0402C330J9RAUTO
D29 D30 D32 D35 D38 D39 D42 D46 = Diode - LED (0402-Blue): Standard LEDs - SMD PICOLEDTM;BLUE LED; 25M @ 5MA; Manufacturer_Name: ROHM Semiconductor; Manufacturer_Part_Number: SMLP13BC8TT86; Mouser_Part_Number: 755-SMLP13BC8TT86; ROHS: Yes; ComponentLink1Description: DataSheet; ComponentLink1URL: https://d1d2qsbl8m0m72.cloudfront.net/en/products/databook/datasheet/opto/led/chip_mono/sml-p1-e.pdf; ComponentLink2Description: Mouser; ComponentLink2URL: https://www.mouser.com.tr/ProductDetail/ROHM-Semiconductor/SMLP13BC8TT86?qs=%2Fha2pyFaduidYDgXFKL%252BNZwCVZNUI4FlyPWWbVDx1b6ABmzS%252BS2f0w%3D%3D; Supplier 1: Mouser; Supplier 2: Digi-Key; Supplier Part Number 1: 755-SMLP13BC8TT86; Supplier Part Number 2: 846-1112-1-ND
Q25-Q27 Q31 Q34 Q35 Q38 Q41 = Transistor - BC847: Bipolar Transistors - BJT BC847AQA/DFN1010D-3/REEL 7" Q2; Mouser_Part_Number: 771-BC847AQAZ; ComponentLink1Description: DataSheet; ComponentLink1URL: https://www.mouser.com.tr/datasheet/2/916/BC847XQA_SER-1598405.pdf; ComponentLink2Description: Mouser; ComponentLink2URL: https://www.mouser.com.tr/ProductDetail/Nexperia/BC847AQAZ?qs=%2Fha2pyFaduhKMCPKNtQimeJpXTw9z4AqURd2YARs8DVICZNv3AT9Dw%3D%3D; Case: DFN-1010D-3; Supplier 1: Mouser; Supplier 2: Digi-Key; Supplier Part Number 1: 771-BC847AQAZ; Supplier Part Number 2: 1727-2545-1-ND
R69 R72 R75 R82 R85 R88 R93 R99 = Resistor - 330R: Thick Film Resistors - SMD 1/16 W 330 Ohm 1%; Manufacturer Name: Vishay; Manufacturer Part Number: CRCW0402330RFKED; Height: 0.4mm; ComponentLink1Description: DataSheet; ComponentLink1URL: https://www.mouser.com.tr/datasheet/2/427/dcrcwe3-1762152.pdf; ComponentLink2Description: Mouser; ComponentLink2URL: https://www.mouser.com.tr/ProductDetail/Vishay-Dale/CRCW0402330RFKED?qs=sGAEpiMZZMu61qfTUdNhG2DpbjADlD3GGS6SwBlLi5Q%3D; Supplier 1: Mouser; Supplier 2: Digi-Key; Supplier Part Number 2: 541-330LCT-ND; Supplier Part Number 1: 71-CRCW0402-330-E3; Mouser Part Number: 71-CRCW0402-330-E3

## Sheet Digital Port F Button.SchDoc: PORT State Change Buttons
size A4; ApprovedBy: Mehmet Günce Akkoyun; CheckedBy: Mehmet Günce Akkoyun; Author: Mehmet Günce Akkoyun; CompanyName: Ovoo Electronics; DrawnBy: Mehmet Günce Akkoyun; Engineer: Mehmet Günce Akkoyun; Organization: Ovoo Electronics; Address1: Necip Fazýl Mah. Ortaýrmak Sok.; Address2: Birgül Apt. No: 19/6; Address3: Meram / Konya; Address4: Turkiye; DocumentNumber: AA001; Revision: B100AA Dev Kit
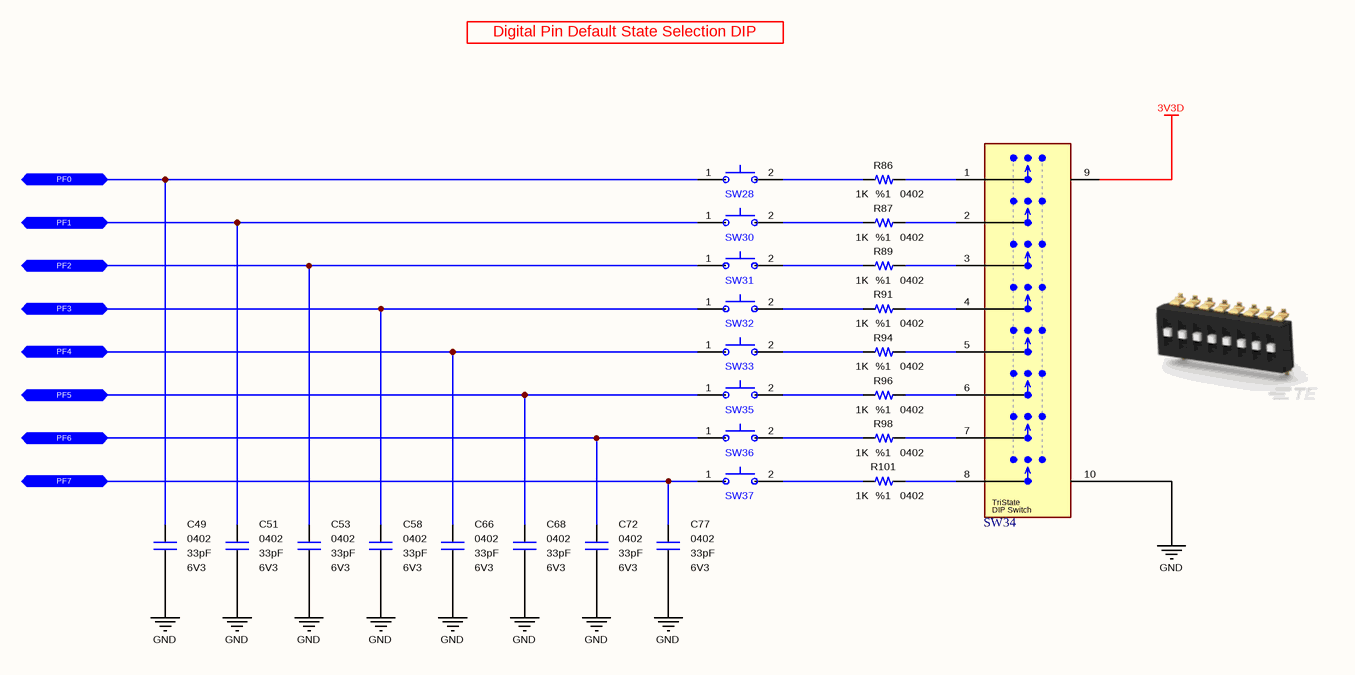
[diagram p13: Digital Port F Button.SchDoc]

### Parts
C49  value 33pF  Case: 0402  Voltage: 6V3  [CAPACITOR_0402]  (hidden comment: Multilayer Ceramic Capacitor)
C51  value 33pF  Case: 0402  Voltage: 6V3  [CAPACITOR_0402]  (hidden comment: Multilayer Ceramic Capacitor)
C53  value 33pF  Case: 0402  Voltage: 6V3  [CAPACITOR_0402]  (hidden comment: Multilayer Ceramic Capacitor)
C58  value 33pF  Case: 0402  Voltage: 6V3  [CAPACITOR_0402]  (hidden comment: Multilayer Ceramic Capacitor)
C66  value 33pF  Case: 0402  Voltage: 6V3  [CAPACITOR_0402]  (hidden comment: Multilayer Ceramic Capacitor)
C68  value 33pF  Case: 0402  Voltage: 6V3  [CAPACITOR_0402]  (hidden comment: Multilayer Ceramic Capacitor)
C72  value 33pF  Case: 0402  Voltage: 6V3  [CAPACITOR_0402]  (hidden comment: Multilayer Ceramic Capacitor)
C77  value 33pF  Case: 0402  Voltage: 6V3  [CAPACITOR_0402]  (hidden comment: Multilayer Ceramic Capacitor)
R86  value 1K  Tolerance: %1  Case: 0402  [RESISTOR_0402]  (hidden comment: Thick Film Resistor)
R87  value 1K  Tolerance: %1  Case: 0402  [RESISTOR_0402]  (hidden comment: Thick Film Resistor)
R89  value 1K  Tolerance: %1  Case: 0402  [RESISTOR_0402]  (hidden comment: Thick Film Resistor)
R91  value 1K  Tolerance: %1  Case: 0402  [RESISTOR_0402]  (hidden comment: Thick Film Resistor)
R94  value 1K  Tolerance: %1  Case: 0402  [RESISTOR_0402]  (hidden comment: Thick Film Resistor)
R96  value 1K  Tolerance: %1  Case: 0402  [RESISTOR_0402]  (hidden comment: Thick Film Resistor)
R98  value 1K  Tolerance: %1  Case: 0402  [RESISTOR_0402]  (hidden comment: Thick Film Resistor)
R101  value 1K  Tolerance: %1  Case: 0402  [RESISTOR_0402]  (hidden comment: Thick Film Resistor)
SW28  Tactile Switches  [PTS526_Switch]  (value not drawn)
SW30  Tactile Switches  [PTS526_Switch]  (value not drawn)
SW31  Tactile Switches  [PTS526_Switch]  (value not drawn)
SW32  Tactile Switches  [PTS526_Switch]  (value not drawn)
SW33  Tactile Switches  [PTS526_Switch]  (value not drawn)
SW34  DIP Switches/SIP Switches  [TDS08SGNNTR04]  (value not drawn)
SW35  Tactile Switches  [PTS526_Switch]  (value not drawn)
SW36  Tactile Switches  [PTS526_Switch]  (value not drawn)
SW37  Tactile Switches  [PTS526_Switch]  (value not drawn)

### Ports
PF0 (bidir), PF1 (bidir), PF2 (bidir), PF3 (bidir), PF4 (bidir), PF5 (bidir), PF6 (bidir), PF7 (bidir)

### Nets
3V3D: SW34.9(VCC)
GND: C49.1 C51.1 C53.1 C58.1 C66.1 C68.1 C72.1 C77.1 SW34.10(GND)
PF0: C49.2 SW28.1(NC) ; port PF0
PF1: C51.2 SW30.1(NC) ; port PF1
PF2: C53.2 SW31.1(NC) ; port PF2
PF3: C58.2 SW32.1(NC) ; port PF3
PF4: C66.2 SW33.1(NC) ; port PF4
PF5: C68.2 SW35.1(NC) ; port PF5
PF6: C72.2 SW36.1(NC) ; port PF6
PF7: C77.2 SW37.1(NC) ; port PF7
NetR86_1: R86.1 SW34.1
NetR86_2: R86.2 SW28.2(COM)
NetR87_1: R87.1 SW34.2
NetR87_2: R87.2 SW30.2(COM)
NetR89_1: R89.1 SW34.3
NetR89_2: R89.2 SW31.2(COM)
NetR91_1: R91.1 SW34.4
NetR91_2: R91.2 SW32.2(COM)
NetR94_1: R94.1 SW34.5
NetR94_2: R94.2 SW33.2(COM)
NetR96_1: R96.1 SW34.6
NetR96_2: R96.2 SW35.2(COM)
NetR98_1: R98.1 SW34.7
NetR98_2: R98.2 SW36.2(COM)
NetR101_1: R101.1 SW34.8
NetR101_2: R101.2 SW37.2(COM)

### Notes on the sheet
- Digital Pin Default State Selection DIP
- Title
- Size:
- Date:
- A4
- Number:
- Time:
- Revision:
- Sheet
- of
- File:
- (in symbol Switch - DIP Switch (8 Pole TriState)) TriState; DIP Switch

### Library data of the parts
C49 C51 C53 C58 C66 C68 C72 C77 = Capacitor - 33pF [0402-6V3]: as C50 on sheet Digital Port F State LED Inducator; Height: 0.5mm; Mouser Part Number: 80-C0402C330J9RAUTO; Maximum Operating Temperature: +125; Minimum Operating Temperature: -55; ROHS: Yes; ComponentLink1Description: DataSheet; ComponentLink1URL: https://api.kemet.com/component-edge/download/datasheet/C0402C330J9RACAUTO.pdf; ComponentLink2Description: Mouser; ComponentLink2URL: https://www.mouser.com/Search/Refine.aspx?Keyword=80-C0402C330J9RAUTO; Supplier 1: Mouser; Supplier Part Number 1: 80-C0402C330J9RAUTO
R86 R87 R89 R91 R94 R96 R98 R101 = Resistor - 1K: Thick Film Resistors - SMD 1/16 W 1.0 Kohms 1%; Manufacturer Name: Vishay; Manufacturer Part Number: CRCW04021K00FKED; Height: 0.35mm; Mouser Part Number: 71-CRCW0402-1.0K-E3; ComponentLink1Description: DataSheet; ComponentLink1URL: https://www.mouser.com.tr/datasheet/2/427/dcrcwe3-1762152.pdf; ComponentLink2Description: Mouser; ComponentLink2URL: https://www.mouser.com.tr/ProductDetail/Vishay-Dale/CRCW04021K00FKED?qs=sGAEpiMZZMu61qfTUdNhG2DpbjADlD3GFJ4zSbeLqG8%3D; Supplier 1: Mouser; Supplier 2: Digi-Key; Supplier Part Number 1: 71-CRCW0402-1.0K-E3; Supplier Part Number 2: 541-1.00KLCT-ND
SW28 SW30-SW33 SW35-SW37 = Switch - Tactile: Tactile Switches 50mA 12VDC, 5.2x5.2mm, 0.8mm H, 260gf, G leads.; Manufacturer Name: C&K Switches; Manufacturer Part Number: PTS526 SK08 SMTR2 LFS; Height: 0.8mm; Mouser Part Number: 611-PTS526SK08SMTR2L; ComponentLink1Description: DataSheet; ComponentLink1URL: https://eu.mouser.com/datasheet/2/60/pts526-1651200.pdf; ComponentLink2Description: Mouser; ComponentLink2URL: https://eu.mouser.com/ProductDetail/CK/PTS526-SK08-SMTR2-LFS?qs=sGAEpiMZZMsgGjVA3toVBL%2FRce%252ByN3s1hQPqiLlQ%252BeM%3D; Supplier 1: Future Electronics; Supplier 2: Mouser; Supplier 3: Arrow; Supplier 4: Digi-Key; Supplier Part Number 1: PTS526SK08SMTR2LFS-REEL; Supplier Part Number 2: 611-PTS526SK08SMTR2L; Supplier Part Number 3: PTS526 SK08 SMTR2 LFS; Supplier Part Number 4: CKN12219-1-ND
SW34 = Switch - DIP Switch (8 Pole TriState): as SW29 on sheet Digital Port F Default State DIP; Manufacturer Part Number: TDS08SGNNTR04; Mouser Part Number: 506-TDS08SGNNTR04; ComponentLink1Description: DataSheet; ComponentLink1URL: https://www.mouser.com.tr/datasheet/2/418/4/NG_DS_1-1773931-8_ALCOSWITCH_DIP_TDS_0917-1221113.pdf; ComponentLink2Description: Mouser; ComponentLink2URL: https://www.mouser.com.tr/ProductDetail/TE-Connectivity-Alcoswitch/TDS08SGNNTR04/?qs=wd5RIQLrsJiLOOX2pWoyQw==

## Sheet Digital Port K.SchDoc: Port K Digital Control
size A4; ApprovedBy: Mehmet Günce Akkoyun; CheckedBy: Mehmet Günce Akkoyun; Author: Mehmet Günce Akkoyun; CompanyName: Ovoo Electronics; DrawnBy: Mehmet Günce Akkoyun; Engineer: Mehmet Günce Akkoyun; Organization: Ovoo Electronics; Address1: Necip Fazýl Mah. Ortaýrmak Sok.; Address2: Birgül Apt. No: 19/6; Address3: Meram / Konya; Address4: Turkiye; DocumentNumber: AA001; Revision: B100AA Dev Kit
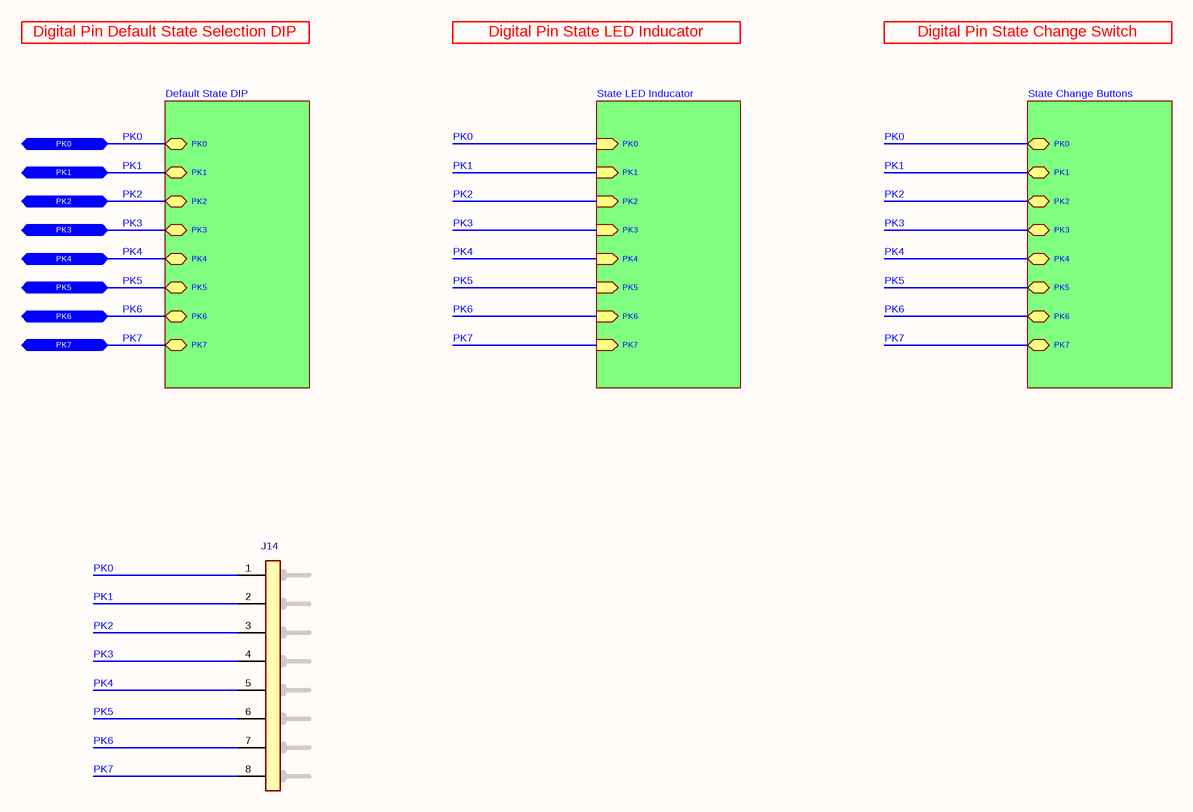
[diagram p14: Digital Port K.SchDoc]

### Parts
J14  2.54 mm Pitch 8P Male Connector  [8P Header]  (value not drawn)

### Sub-sheets
Default State DIP = Digital Port K Default State DIP.SchDoc: PK1 (bidir), PK0 (bidir), PK7 (bidir), PK4 (bidir), PK6 (bidir), PK3 (bidir), PK5 (bidir), PK2 (bidir)
State Change Buttons = Digital Port K Button.SchDoc: PK1 (bidir), PK0 (bidir), PK7 (bidir), PK4 (bidir), PK6 (bidir), PK3 (bidir), PK5 (bidir), PK2 (bidir)
State LED Inducator = Digital Port K State LED Inducator.SchDoc: PK1 (in), PK0 (in), PK7 (in), PK4 (in), PK6 (in), PK3 (in), PK5 (in), PK2 (in)

### Ports
PK0 (bidir), PK1 (bidir), PK2 (bidir), PK3 (bidir), PK4 (bidir), PK5 (bidir), PK6 (bidir), PK7 (bidir)

### Nets
PK0: J14.1(Pin-1) ; port PK0, sheet Default State DIP/PK0, sheet State LED Inducator/PK0, sheet State Change Buttons/PK0
PK1: J14.2(Pin-2) ; port PK1, sheet Default State DIP/PK1, sheet State LED Inducator/PK1, sheet State Change Buttons/PK1
PK2: J14.3(Pin-3) ; port PK2, sheet Default State DIP/PK2, sheet State LED Inducator/PK2, sheet State Change Buttons/PK2
PK3: J14.4(Pin-4) ; port PK3, sheet Default State DIP/PK3, sheet State LED Inducator/PK3, sheet State Change Buttons/PK3
PK4: J14.5(Pin-5) ; port PK4, sheet Default State DIP/PK4, sheet State LED Inducator/PK4, sheet State Change Buttons/PK4
PK5: J14.6(Pin-6) ; port PK5, sheet Default State DIP/PK5, sheet State LED Inducator/PK5, sheet State Change Buttons/PK5
PK6: J14.7(Pin-7) ; port PK6, sheet Default State DIP/PK6, sheet State LED Inducator/PK6, sheet State Change Buttons/PK6
PK7: J14.8(Pin-8) ; port PK7, sheet Default State DIP/PK7, sheet State LED Inducator/PK7, sheet State Change Buttons/PK7

### Notes on the sheet
- Digital Pin Default State Selection DIP
- Digital Pin State LED Inducator
- Digital Pin State Change Switch
- Title
- Size:
- Date:
- A4
- Number:
- Time:
- Revision:
- Sheet
- of
- File:

### Library data of the parts
J14 = Connector - Male Header 8P (2.54): as J10 on sheet Digital Port F; Manufacturer Part Number: 22-28-4083; Mouser Part Number: 538-22-28-4083; ROHS: Yes; ComponentLink1Description: DataSheet; ComponentLink1URL: https://www.mouser.com.tr/datasheet/2/276/0022284063_PCB_HEADERS-228265.pdf; ComponentLink2Description: Mouser; ComponentLink2URL: https://www.mouser.com.tr/ProductDetail/Molex/22-28-4083/?qs=%2Fha2pyFaduguMWEp6M%252Bj0x6fHxUvnRGD%252BIxBoa6MO5w%3D

## Sheet Digital Port K Default State DIP.SchDoc: PORT K Default State Selection Switch
size A4; ApprovedBy: Mehmet Günce Akkoyun; CheckedBy: Mehmet Günce Akkoyun; Author: Mehmet Günce Akkoyun; CompanyName: Ovoo Electronics; DrawnBy: Mehmet Günce Akkoyun; Engineer: Mehmet Günce Akkoyun; Organization: Ovoo Electronics; Address1: Necip Fazýl Mah. Ortaýrmak Sok.; Address2: Birgül Apt. No: 19/6; Address3: Meram / Konya; Address4: Turkiye; DocumentNumber: AA001; Revision: B100AA Dev Kit
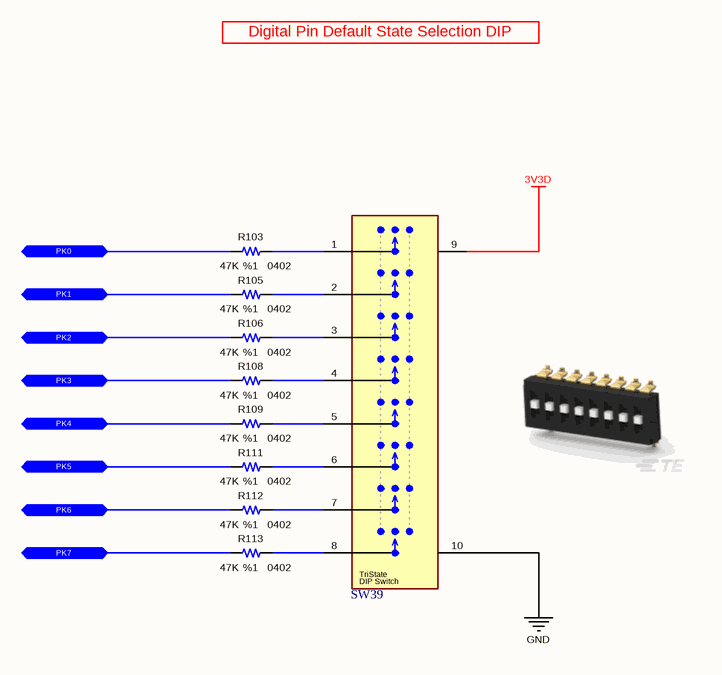
[diagram p15: Digital Port K Default State DIP.SchDoc]

### Parts
R103  value 47K  Tolerance: %1  Case: 0402  [RESISTOR_0402]  (hidden comment: Thick Film Resistor)
R105  value 47K  Tolerance: %1  Case: 0402  [RESISTOR_0402]  (hidden comment: Thick Film Resistor)
R106  value 47K  Tolerance: %1  Case: 0402  [RESISTOR_0402]  (hidden comment: Thick Film Resistor)
R108  value 47K  Tolerance: %1  Case: 0402  [RESISTOR_0402]  (hidden comment: Thick Film Resistor)
R109  value 47K  Tolerance: %1  Case: 0402  [RESISTOR_0402]  (hidden comment: Thick Film Resistor)
R111  value 47K  Tolerance: %1  Case: 0402  [RESISTOR_0402]  (hidden comment: Thick Film Resistor)
R112  value 47K  Tolerance: %1  Case: 0402  [RESISTOR_0402]  (hidden comment: Thick Film Resistor)
R113  value 47K  Tolerance: %1  Case: 0402  [RESISTOR_0402]  (hidden comment: Thick Film Resistor)
SW39  DIP Switches/SIP Switches  [TDS08SGNNTR04]  (value not drawn)

### Ports
PK0 (bidir), PK1 (bidir), PK2 (bidir), PK3 (bidir), PK4 (bidir), PK5 (bidir), PK6 (bidir), PK7 (bidir)

### Nets
3V3D: SW39.9(VCC)
GND: SW39.10(GND)
PK0: R103.2 ; port PK0
PK1: R105.2 ; port PK1
PK2: R106.2 ; port PK2
PK3: R108.2 ; port PK3
PK4: R109.2 ; port PK4
PK5: R111.2 ; port PK5
PK6: R112.2 ; port PK6
PK7: R113.2 ; port PK7
NetR103_1: R103.1 SW39.1
NetR105_1: R105.1 SW39.2
NetR106_1: R106.1 SW39.3
NetR108_1: R108.1 SW39.4
NetR109_1: R109.1 SW39.5
NetR111_1: R111.1 SW39.6
NetR112_1: R112.1 SW39.7
NetR113_1: R113.1 SW39.8

### Notes on the sheet
- Digital Pin Default State Selection DIP
- Title
- Size:
- Date:
- A4
- Number:
- Time:
- Revision:
- Sheet
- of
- File:
- (in symbol Switch - DIP Switch (8 Pole TriState)) TriState; DIP Switch

### Library data of the parts
R103 R105 R106 R108 R109 R111-R113 = Resistor - 47K: as R68 on sheet Digital Port F Default State DIP; Height: 0.4mm; Mouser Part Number: 71-CRCW0402-47K-E3; ComponentLink1Description: DataSheet; ComponentLink1URL: https://www.mouser.com.tr/datasheet/2/427/dcrcwe3-1762152.pdf; ComponentLink2Description: Mouser; ComponentLink2URL: https://www.mouser.com.tr/ProductDetail/Vishay-Dale/CRCW040247K0FKED?qs=sGAEpiMZZMu61qfTUdNhG2DpbjADlD3GL%252B3h1elTxqU%3D; Supplier 1: Mouser; Supplier 2: Digi-Key; Supplier Part Number 1: 71-CRCW040247K0FKEDH; Supplier Part Number 2: 541-47.0KYCT-ND
SW39 = Switch - DIP Switch (8 Pole TriState): as SW29 on sheet Digital Port F Default State DIP; Manufacturer Part Number: TDS08SGNNTR04; Mouser Part Number: 506-TDS08SGNNTR04; ComponentLink1Description: DataSheet; ComponentLink1URL: https://www.mouser.com.tr/datasheet/2/418/4/NG_DS_1-1773931-8_ALCOSWITCH_DIP_TDS_0917-1221113.pdf; ComponentLink2Description: Mouser; ComponentLink2URL: https://www.mouser.com.tr/ProductDetail/TE-Connectivity-Alcoswitch/TDS08SGNNTR04/?qs=wd5RIQLrsJiLOOX2pWoyQw==

## Sheet Digital Port K State LED Inducator.SchDoc: PORT State LED Inducator
size A3; ApprovedBy: Mehmet Günce Akkoyun; CheckedBy: Mehmet Günce Akkoyun; Author: Mehmet Günce Akkoyun; CompanyName: Ovoo Electronics; DrawnBy: Mehmet Günce Akkoyun; Engineer: Mehmet Günce Akkoyun; Organization: Ovoo Electronics; Address1: Necip Fazýl Mah. Ortaýrmak Sok.; Address2: Birgül Apt. No: 19/6; Address3: Meram / Konya; Address4: Turkiye; DocumentNumber: AA001; Revision: B100AA Dev Kit
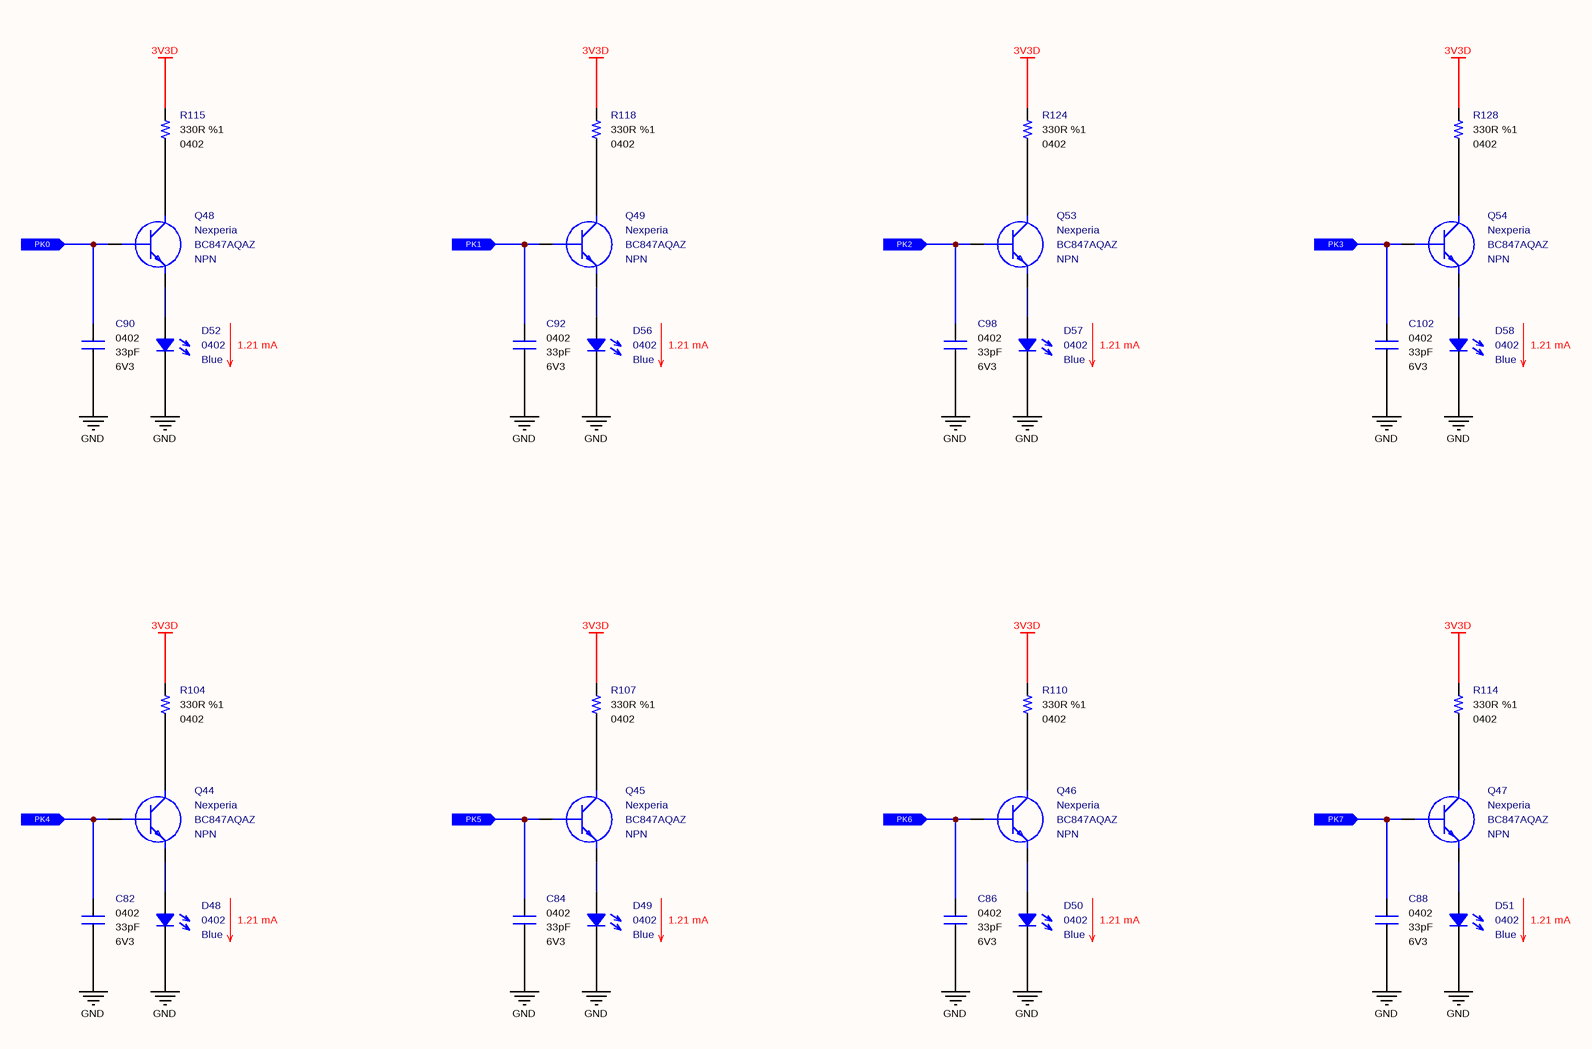
[diagram p16: Digital Port K State LED Inducator.SchDoc]

### Parts
C82  value 33pF  Case: 0402  Voltage: 6V3  [CAPACITOR_0402]  (hidden comment: Multilayer Ceramic Capacitor)
C84  value 33pF  Case: 0402  Voltage: 6V3  [CAPACITOR_0402]  (hidden comment: Multilayer Ceramic Capacitor)
C86  value 33pF  Case: 0402  Voltage: 6V3  [CAPACITOR_0402]  (hidden comment: Multilayer Ceramic Capacitor)
C88  value 33pF  Case: 0402  Voltage: 6V3  [CAPACITOR_0402]  (hidden comment: Multilayer Ceramic Capacitor)
C90  value 33pF  Case: 0402  Voltage: 6V3  [CAPACITOR_0402]  (hidden comment: Multilayer Ceramic Capacitor)
C92  value 33pF  Case: 0402  Voltage: 6V3  [CAPACITOR_0402]  (hidden comment: Multilayer Ceramic Capacitor)
C98  value 33pF  Case: 0402  Voltage: 6V3  [CAPACITOR_0402]  (hidden comment: Multilayer Ceramic Capacitor)
C102  value 33pF  Case: 0402  Voltage: 6V3  [CAPACITOR_0402]  (hidden comment: Multilayer Ceramic Capacitor)
D48  Case: 0402  Color: Blue  [LED_0402]  (hidden comment: SMD LED (Blue))
D49  Case: 0402  Color: Blue  [LED_0402]  (hidden comment: SMD LED (Blue))
D50  Case: 0402  Color: Blue  [LED_0402]  (hidden comment: SMD LED (Blue))
D51  Case: 0402  Color: Blue  [LED_0402]  (hidden comment: SMD LED (Blue))
D52  Case: 0402  Color: Blue  [LED_0402]  (hidden comment: SMD LED (Blue))
D56  Case: 0402  Color: Blue  [LED_0402]  (hidden comment: SMD LED (Blue))
D57  Case: 0402  Color: Blue  [LED_0402]  (hidden comment: SMD LED (Blue))
D58  Case: 0402  Color: Blue  [LED_0402]  (hidden comment: SMD LED (Blue))
Q44  Manufacturer_Name: Nexperia  Manufacturer_Part_Number: BC847AQAZ  Polarity: NPN  [SOT1215]  (hidden comment: Bipolar NPN Transistors)
Q45  Manufacturer_Name: Nexperia  Manufacturer_Part_Number: BC847AQAZ  Polarity: NPN  [SOT1215]  (hidden comment: Bipolar NPN Transistors)
Q46  Manufacturer_Name: Nexperia  Manufacturer_Part_Number: BC847AQAZ  Polarity: NPN  [SOT1215]  (hidden comment: Bipolar NPN Transistors)
Q47  Manufacturer_Name: Nexperia  Manufacturer_Part_Number: BC847AQAZ  Polarity: NPN  [SOT1215]  (hidden comment: Bipolar NPN Transistors)
Q48  Manufacturer_Name: Nexperia  Manufacturer_Part_Number: BC847AQAZ  Polarity: NPN  [SOT1215]  (hidden comment: Bipolar NPN Transistors)
Q49  Manufacturer_Name: Nexperia  Manufacturer_Part_Number: BC847AQAZ  Polarity: NPN  [SOT1215]  (hidden comment: Bipolar NPN Transistors)
Q53  Manufacturer_Name: Nexperia  Manufacturer_Part_Number: BC847AQAZ  Polarity: NPN  [SOT1215]  (hidden comment: Bipolar NPN Transistors)
Q54  Manufacturer_Name: Nexperia  Manufacturer_Part_Number: BC847AQAZ  Polarity: NPN  [SOT1215]  (hidden comment: Bipolar NPN Transistors)
R104  value 330R  Tolerance: %1  Case: 0402  [RESISTOR_0402]  (hidden comment: Thick Film Resistor)
R107  value 330R  Tolerance: %1  Case: 0402  [RESISTOR_0402]  (hidden comment: Thick Film Resistor)
R110  value 330R  Tolerance: %1  Case: 0402  [RESISTOR_0402]  (hidden comment: Thick Film Resistor)
R114  value 330R  Tolerance: %1  Case: 0402  [RESISTOR_0402]  (hidden comment: Thick Film Resistor)
R115  value 330R  Tolerance: %1  Case: 0402  [RESISTOR_0402]  (hidden comment: Thick Film Resistor)
R118  value 330R  Tolerance: %1  Case: 0402  [RESISTOR_0402]  (hidden comment: Thick Film Resistor)
R124  value 330R  Tolerance: %1  Case: 0402  [RESISTOR_0402]  (hidden comment: Thick Film Resistor)
R128  value 330R  Tolerance: %1  Case: 0402  [RESISTOR_0402]  (hidden comment: Thick Film Resistor)

### Ports
PK0 (in), PK1 (in), PK2 (in), PK3 (in), PK4 (in), PK5 (in), PK6 (in), PK7 (in)

### Nets
3V3D: R104.2 R107.2 R110.2 R114.2 R115.2 R118.2 R124.2 R128.2
GND: C82.2 C84.2 C86.2 C88.2 C90.2 C92.2 C98.2 C102.2 D48.1 D49.1 D50.1 D51.1 D52.1 D56.1 D57.1 D58.1
PK0: C90.1 Q48.1(B) ; port PK0
PK1: C92.1 Q49.1(B) ; port PK1
PK2: C98.1 Q53.1(B) ; port PK2
PK3: C102.1 Q54.1(B) ; port PK3
PK4: C82.1 Q44.1(B) ; port PK4
PK5: C84.1 Q45.1(B) ; port PK5
PK6: C86.1 Q46.1(B) ; port PK6
PK7: C88.1 Q47.1(B) ; port PK7
NetD48_2: D48.2 Q44.2(E)
NetD49_2: D49.2 Q45.2(E)
NetD50_2: D50.2 Q46.2(E)
NetD51_2: D51.2 Q47.2(E)
NetD52_2: D52.2 Q48.2(E)
NetD56_2: D56.2 Q49.2(E)
NetD57_2: D57.2 Q53.2(E)
NetD58_2: D58.2 Q54.2(E)
NetQ44_3: Q44.3(C) R104.1
NetQ45_3: Q45.3(C) R107.1
NetQ46_3: Q46.3(C) R110.1
NetQ47_3: Q47.3(C) R114.1
NetQ48_3: Q48.3(C) R115.1
NetQ49_3: Q49.3(C) R118.1
NetQ53_3: Q53.3(C) R124.1
NetQ54_3: Q54.3(C) R128.1

### Notes on the sheet
- 1.21 mA
- Title
- Size:
- Date:
- A3
- Number:
- Time:
- Revision:
- Sheet
- of
- File:

### Library data of the parts
C82 C84 C86 C88 C90 C92 C98 C102 = Capacitor - 33pF [0402-6V3]: as C50 on sheet Digital Port F State LED Inducator; Height: 0.5mm; Maximum Operating Temperature: +125; Minimum Operating Temperature: -55; ROHS: Yes; ComponentLink1Description: DataSheet; ComponentLink1URL: https://api.kemet.com/component-edge/download/datasheet/C0402C330J9RACAUTO.pdf; ComponentLink2Description: Mouser; ComponentLink2URL: https://www.mouser.com/Search/Refine.aspx?Keyword=80-C0402C330J9RAUTO; Supplier 1: Mouser; Supplier Part Number 1: 80-C0402C330J9RAUTO; Mouser Part Number: 80-C0402C330J9RAUTO
D48-D52 D56-D58 = Diode - LED (0402-Blue): as D29 on sheet Digital Port F State LED Inducator; Mouser_Part_Number: 755-SMLP13BC8TT86; ROHS: Yes; ComponentLink1Description: DataSheet; ComponentLink1URL: https://d1d2qsbl8m0m72.cloudfront.net/en/products/databook/datasheet/opto/led/chip_mono/sml-p1-e.pdf; ComponentLink2Description: Mouser; ComponentLink2URL: https://www.mouser.com.tr/ProductDetail/ROHM-Semiconductor/SMLP13BC8TT86?qs=%2Fha2pyFaduidYDgXFKL%252BNZwCVZNUI4FlyPWWbVDx1b6ABmzS%252BS2f0w%3D%3D; Supplier 1: Mouser; Supplier 2: Digi-Key; Supplier Part Number 1: 755-SMLP13BC8TT86; Supplier Part Number 2: 846-1112-1-ND
Q44-Q49 Q53 Q54 = Transistor - BC847: as Q25-Q27 on sheet Digital Port F State LED Inducator; Mouser_Part_Number: 771-BC847AQAZ; ComponentLink1Description: DataSheet; ComponentLink1URL: https://www.mouser.com.tr/datasheet/2/916/BC847XQA_SER-1598405.pdf; ComponentLink2Description: Mouser; ComponentLink2URL: https://www.mouser.com.tr/ProductDetail/Nexperia/BC847AQAZ?qs=%2Fha2pyFaduhKMCPKNtQimeJpXTw9z4AqURd2YARs8DVICZNv3AT9Dw%3D%3D; Case: DFN-1010D-3; Supplier 1: Mouser; Supplier 2: Digi-Key; Supplier Part Number 1: 771-BC847AQAZ; Supplier Part Number 2: 1727-2545-1-ND
R104 R107 R110 R114 R115 R118 R124 R128 = Resistor - 330R: as R69 on sheet Digital Port F State LED Inducator; Height: 0.4mm; ComponentLink1Description: DataSheet; ComponentLink1URL: https://www.mouser.com.tr/datasheet/2/427/dcrcwe3-1762152.pdf; ComponentLink2Description: Mouser; ComponentLink2URL: https://www.mouser.com.tr/ProductDetail/Vishay-Dale/CRCW0402330RFKED?qs=sGAEpiMZZMu61qfTUdNhG2DpbjADlD3GGS6SwBlLi5Q%3D; Supplier 1: Mouser; Supplier 2: Digi-Key; Supplier Part Number 2: 541-330LCT-ND; Supplier Part Number 1: 71-CRCW0402-330-E3; Mouser Part Number: 71-CRCW0402-330-E3